# EAGLE design HackflightBrushed (EAGLE 7.7.0)
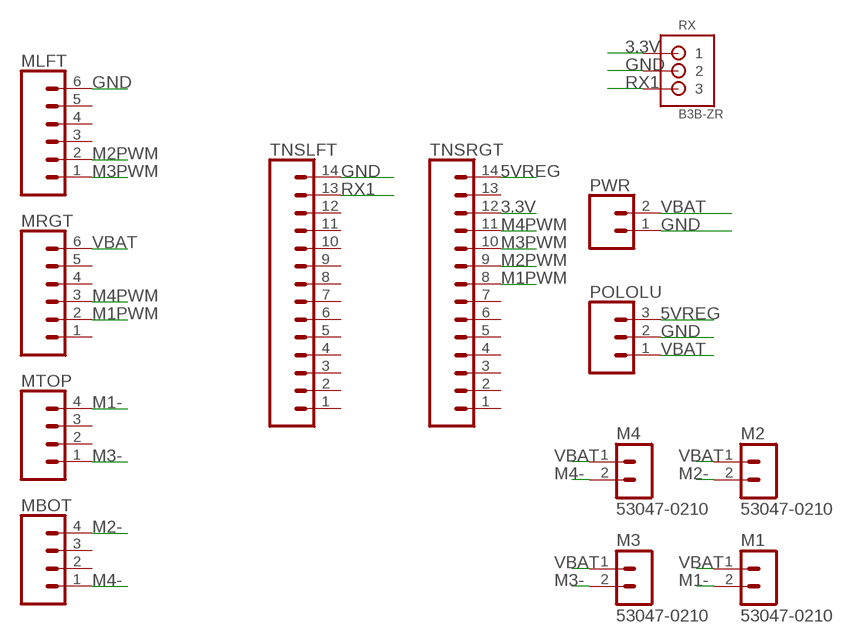
[diagram p0: schematic, sheet 1]

## Parts
M1  53047-0210  [53047-0210]
M2  53047-0210  [53047-0210]
M3  53047-0210  [53047-0210]
M4  53047-0210  [53047-0210]
MBOT  CONN_04  [1X04]
MLFT  CONN_06NO_SILK_FEMALE_PTH  [1X06_NO_SILK]
MRGT  CONN_06NO_SILK_FEMALE_PTH  [1X06_NO_SILK]
MTOP  CONN_04  [1X04]
POLOLU  CONN_03  [1X03]
PWR  CONN_02  [1X02]
RX  B3B-ZR  [B3B-ZR]
TNSLFT  CONN_14  [1X14]
TNSRGT  CONN_14  [1X14]

## Nets
3.3V: RX.1 TNSRGT.12
5VREG: POLOLU.3 TNSRGT.14
GND: MLFT.6 POLOLU.2 PWR.1 RX.2 TNSLFT.14
M1-: M1.2 MTOP.4
M1PWM: MRGT.2 TNSRGT.8
M2-: M2.2 MBOT.4
M2PWM: MLFT.2 TNSRGT.9
M3-: M3.2 MTOP.1
M3PWM: MLFT.1 TNSRGT.10
M4-: M4.2 MBOT.1
M4PWM: MRGT.3 TNSRGT.11
RX1: RX.3 TNSLFT.13
VBAT: M1.1 M2.1 M3.1 M4.1 MRGT.6 POLOLU.1 PWR.2
Unconnected: MBOT.2 MBOT.3 MLFT.3 MLFT.4 MLFT.5 MRGT.1 MRGT.4 MRGT.5 MTOP.2 MTOP.3 TNSLFT.1 TNSLFT.2 TNSLFT.3 TNSLFT.4 TNSLFT.5 TNSLFT.6 TNSLFT.7 TNSLFT.8 TNSLFT.9 TNSLFT.10 TNSLFT.11 TNSLFT.12 TNSRGT.1 TNSRGT.2 TNSRGT.3 TNSRGT.4 TNSRGT.5 TNSRGT.6 TNSRGT.7 TNSRGT.13

## Library data of the parts
M1-M4 = con-molex-picoblade:53047-0210: HEADER
MBOT MTOP = SparkFun-Connectors:CONN_04: Multi connection point. Often used as Generic Header-pin footprint for 0.1 inch spaced/style header connections On any of the 0.1 inch spaced packages, you can populate with these: Break Away Headers - Straight <https://www.sparkfun.com/products/116> (PRT-00116) Break Away Male Headers - Right Angle <https://www.sparkfun.com/products/553> (PRT-00553) Female Headers <https://www.sparkfun.com/products/115> (PRT-00115) Break Away Headers - Machine Pin <https://www.sparkfun.com/products/117> (PRT-00117) Break Away Female Headers - Swiss Machine Pin <https://www.sparkfun.com/products/743> (PRT-00743) For SCREWTERMINALS and SPRING TERMINALS visit here: Screw Terimnals on SparkFun.com <https://www.sparkfun.com/search/results?term=Screw+Terminals> (5mm/3.5mm/2.54mm spacing) This device is also useful as a general connection point to wire up your design to another part of your project. Our various solder wires solder well into these plated through hole pads. Hook-Up Wire - Assortment (Stranded, 22 AWG) <https://www.sparkfun.com/products/11375> (PRT-11375) Hook-Up Wire - Assortment (Solid Core, 22 AWG) <https://www.sparkfun.com/products/11367> (PRT-11367) View the entire wire category on our website here <https://www.sparkfun.com/categories/141> Special notes: Molex polarized connector foot print use with SKU : PRT-08231 with associated crimp pins and housings. 1MM SMD Version SKU: PRT-10208; PROD_ID: CONN-09696
MLFT MRGT = SparkFun-Connectors:CONN_06: Multi connection point. Often used as Generic Header-pin footprint for 0.1 inch spaced/style header connections On any of the 0.1 inch spaced packages, you can populate with these: Break Away Headers - Straight <https://www.sparkfun.com/products/116> (PRT-00116) Break Away Male Headers - Right Angle <https://www.sparkfun.com/products/553> (PRT-00553) Female Headers <https://www.sparkfun.com/products/115> (PRT-00115) Break Away Headers - Machine Pin <https://www.sparkfun.com/products/117> (PRT-00117) Break Away Female Headers - Swiss Machine Pin <https://www.sparkfun.com/products/743> (PRT-00743) Arduino Stackable Header - 6 Pin <https://www.sparkfun.com/products/9280> (PRT-09280) For SCREWTERMINALS and SPRING TERMINALS visit here: Screw Terimnals on SparkFun.com <https://www.sparkfun.com/search/results?term=Screw+Terminals> (5mm/3.5mm/2.54mm spacing) This device is also useful as a general connection point to wire up your design to another part of your project. Our various solder wires solder well into these plated through hole pads. Hook-Up Wire - Assortment (Stranded, 22 AWG) <https://www.sparkfun.com/products/11375> (PRT-11375) Hook-Up Wire - Assortment (Solid Core, 22 AWG) <https://www.sparkfun.com/products/11367> (PRT-11367) View the entire wire category on our website here <https://www.sparkfun.com/categories/141>; PROD_ID: CONN-08437
POLOLU = SparkFun-Connectors:CONN_03: Multi connection point. Often used as Generic Header-pin footprint for 0.1 inch spaced/style header connections On any of the 0.1 inch spaced packages, you can populate with these: Break Away Headers - Straight <https://www.sparkfun.com/products/116> (PRT-00116) Break Away Male Headers - Right Angle <https://www.sparkfun.com/products/553> (PRT-00553) Female Headers <https://www.sparkfun.com/products/115> (PRT-00115) Break Away Headers - Machine Pin <https://www.sparkfun.com/products/117> (PRT-00117) Break Away Female Headers - Swiss Machine Pin <https://www.sparkfun.com/products/743> (PRT-00743) Stackable Header - 3 Pin (Female, 0.1") <https://www.sparkfun.com/products/13875> (PRT-13875) For SCREWTERMINALS and SPRING TERMINALS visit here: Screw Terimnals on SparkFun.com <https://www.sparkfun.com/search/results?term=Screw+Terminals> (5mm/3.5mm/2.54mm spacing) This device is also useful as a general connection point to wire up your design to another part of your project. Our various solder wires solder well into these plated through hole pads. Hook-Up Wire - Assortment (Stranded, 22 AWG) <https://www.sparkfun.com/products/11375> (PRT-11375) Hook-Up Wire - Assortment (Solid Core, 22 AWG) <https://www.sparkfun.com/products/11367> (PRT-11367) View the entire wire category on our website here <https://www.sparkfun.com/categories/141> Special notes: Molex polarized connector foot print use with SKU : PRT-08232 with associated crimp pins and housings.
PWR = SparkFun-Connectors:CONN_02: Multi connection point. Often used as Generic Header-pin footprint for 0.1 inch spaced/style header connections On any of the 0.1 inch spaced packages, you can populate with these: Break Away Headers - Straight <https://www.sparkfun.com/products/116> (PRT-00116) Break Away Male Headers - Right Angle <https://www.sparkfun.com/products/553> (PRT-00553) Female Headers <https://www.sparkfun.com/products/115> (PRT-00115) Break Away Headers - Machine Pin <https://www.sparkfun.com/products/117> (PRT-00117) Break Away Female Headers - Swiss Machine Pin <https://www.sparkfun.com/products/743> (PRT-00743) For SCREWTERMINALS and SPRING TERMINALS visit here: Screw Terimnals on SparkFun.com <https://www.sparkfun.com/search/results?term=Screw+Terminals> (5mm/3.5mm/2.54mm spacing) This device is also useful as a general connection point to wire up your design to another part of your project. Our various solder wires solder well into these plated through hole pads. Hook-Up Wire - Assortment (Stranded, 22 AWG) <https://www.sparkfun.com/products/11375> (PRT-11375) Hook-Up Wire - Assortment (Solid Core, 22 AWG) <https://www.sparkfun.com/products/11367> (PRT-11367) View the entire wire category on our website here <https://www.sparkfun.com/categories/141> Special notes: Molex polarized connector foot print use with: PRT-08233 with associated crimp pins and housings. 2.54_SCREWTERM for use with PRT-10571. 3.5mm Screw Terminal footprints for PRT-08084 5mm Screw Terminal footprints for use with PRT-08432
RX = jst:B3B-ZR: JST-ZH Connector 3 pol, 1.5mm pitch Package: B3B-ZR Source: http://www.jst-mfg.com/product/pdf/eng/eZH.pdf
TNSLFT TNSRGT = SparkFun-Connectors:CONN_14: Multi connection point. Often used as Generic Header-pin footprint for 0.1 inch spaced/style header connections On any of the 0.1 inch spaced packages, you can populate with these: Break Away Headers - Straight <https://www.sparkfun.com/products/116> (PRT-00116) Break Away Male Headers - Right Angle <https://www.sparkfun.com/products/553> (PRT-00553) Female Headers <https://www.sparkfun.com/products/115> (PRT-00115) Break Away Headers - Machine Pin <https://www.sparkfun.com/products/117> (PRT-00117) Break Away Female Headers - Swiss Machine Pin <https://www.sparkfun.com/products/743> (PRT-00743) For SCREWTERMINALS and SPRING TERMINALS visit here: Screw Terimnals on SparkFun.com <https://www.sparkfun.com/search/results?term=Screw+Terminals> (5mm/3.5mm/2.54mm spacing) This device is also useful as a general connection point to wire up your design to another part of your project. Our various solder wires solder well into these plated through hole pads. Hook-Up Wire - Assortment (Stranded, 22 AWG) <https://www.sparkfun.com/products/11375> (PRT-11375) Hook-Up Wire - Assortment (Solid Core, 22 AWG) <https://www.sparkfun.com/products/11367> (PRT-11367) View the entire wire category on our website here <https://www.sparkfun.com/categories/141> Special notes: Molex polarized connector foot print use with SKU : PRT-08231 with associated crimp pins and housings. 1MM SMD Version SKU: PRT-10208 NOTES ON THE VARIANTS LOCK and LOCK_LONGPADS... This footprint was designed to help hold the alignment of a through-hole component (i.e. 6-pin header) while soldering it into place. You may notice that each hole has been shifted either up or down by 0.005 of an inch from it's more standard position (which is a perfectly straight line). This slight alteration caused the pins (the squares in the middle) to touch the edges of the holes. Because they are alternating, it causes a "brace" to hold the component in place. 0.005 has proven to be the perfect amount of "off-center" position when using our standard breakaway headers. Although looks a little odd when you look at the bare footprint, once you have a header in there, the alteration is very hard to notice. Also,if you push a header all the way into place, it is covered up entirely on the bottom side.

## Board
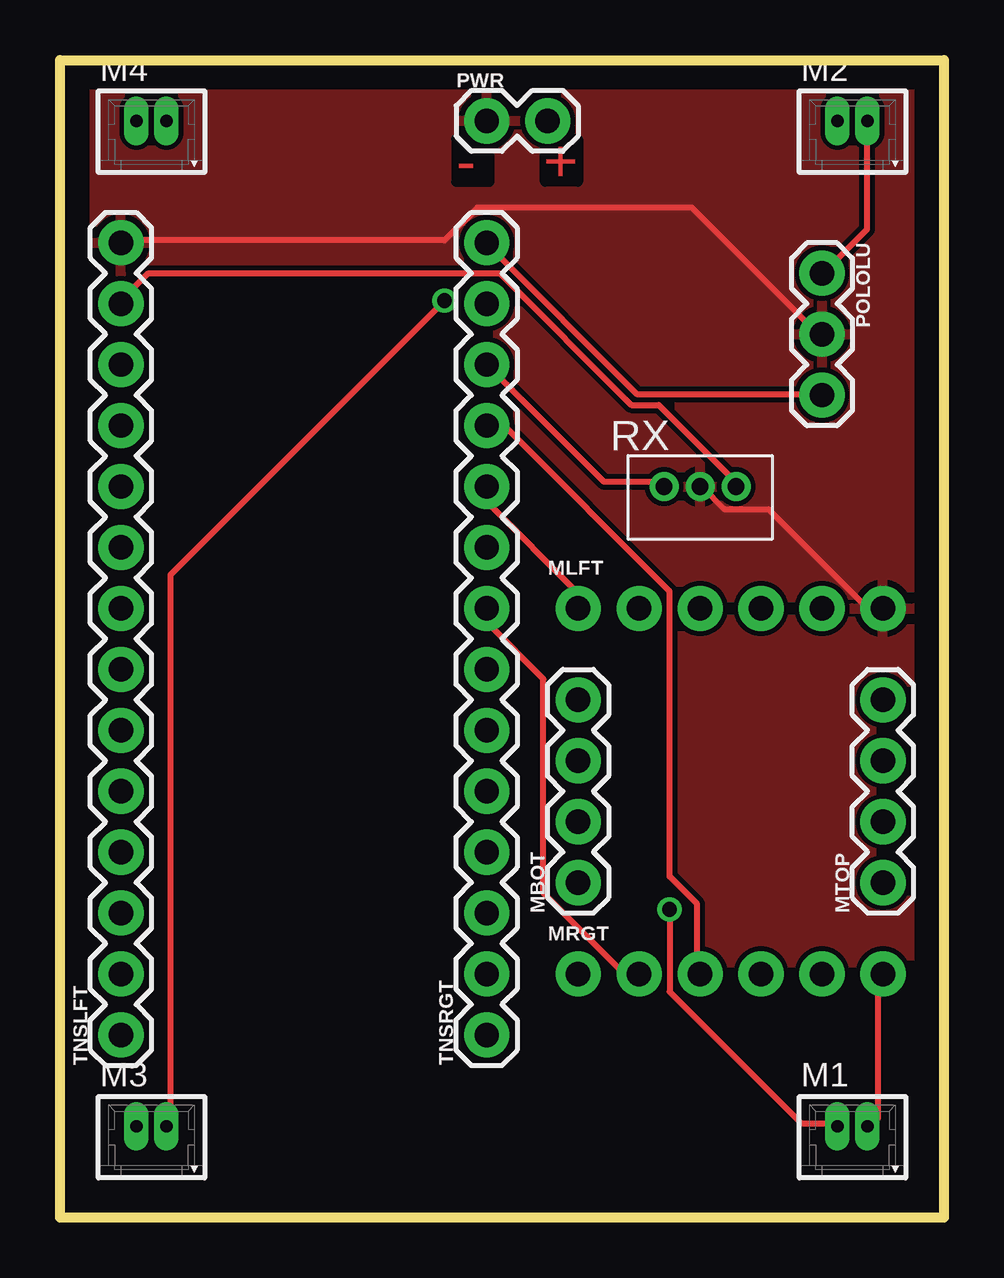
[diagram p1: board, top side]
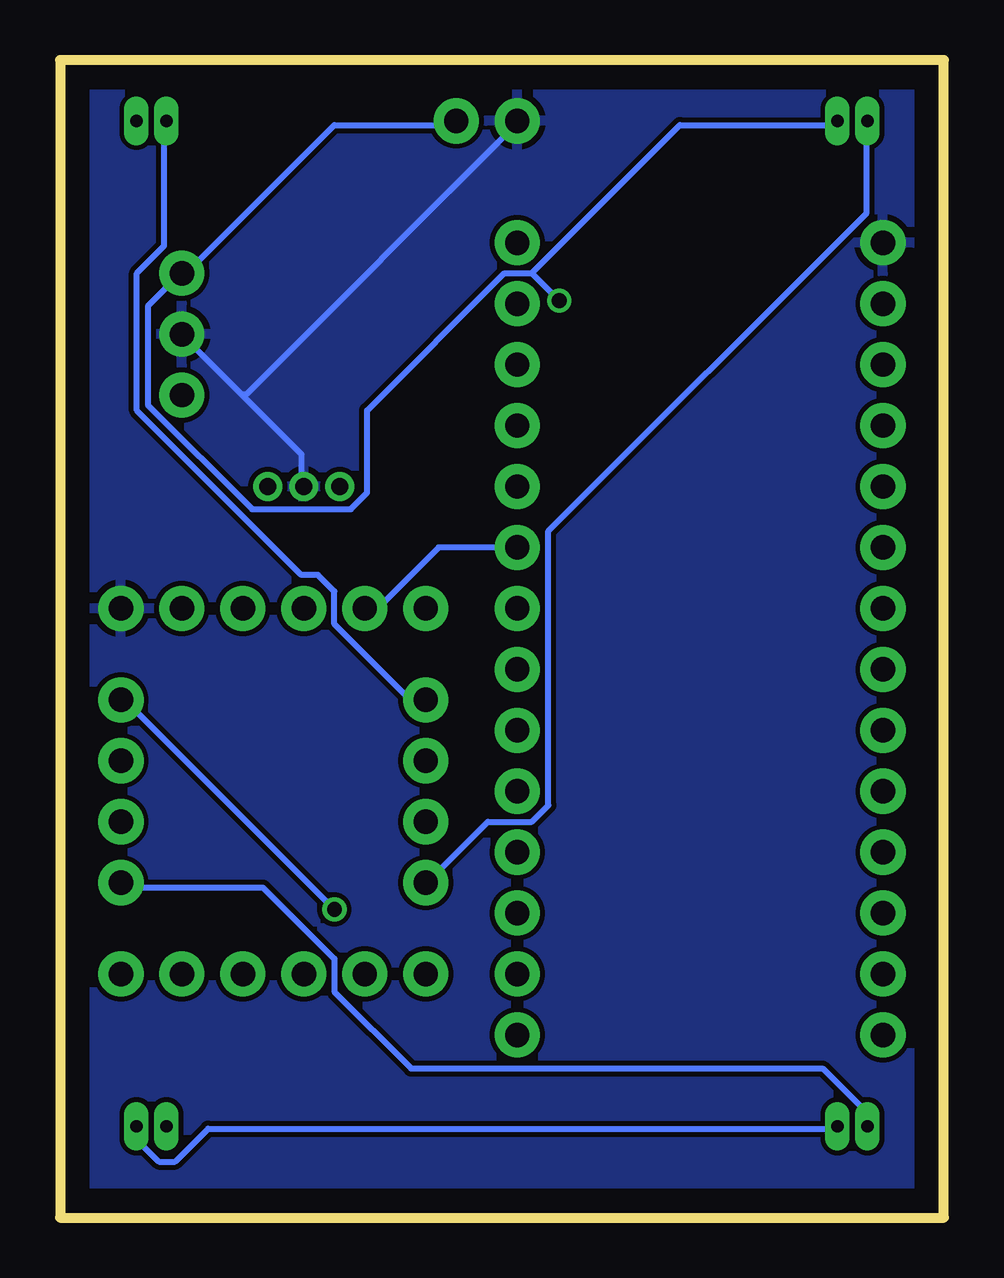
[diagram p2: board, bottom side, seen from below]

Size 36.83 x 48.26 mm. Coordinates in mm from the lower left corner, seen from the top.
Outline: 0,48.26 36.83,48.26 36.83,0 0,0 0,48.26
Copper layers (1*16): Top 0.035mm / dielectric 1.5mm / Bottom 0.035mm
Design rules "default": minimum track width 10mil, minimum drill 24mil, track to track 8mil, track to pad 8mil, pad to pad 8mil, via to via 8mil, smd to smd 8mil, copper to edge 40mil, drill to drill 8mil, minimum pad ring 10mil, minimum via ring 8mil, stop-mask expansion 4mil, vias tented up to drill 0mil, thermal gap 10mil

### Footprints (pad centres in the part's own frame; a part is rotated, then mirrored left to right if it is on the bottom)
53047-0210 = drill 0.508 long: 1 0.625,0; 2 -0.625,0
1X04 = drill 1.016 pad 1.88: 1 0,0; 2 2.54,0; 3 5.08,0; 4 7.62,0
1X06_NO_SILK = drill 1.016 pad 1.88: 1 0,0; 2 2.54,0; 3 5.08,0; 4 7.62,0; 5 10.16,0; 6 12.7,0
1X03 = drill 1.016 pad 1.88: 1 0,0; 2 2.54,0; 3 5.08,0
1X02 = drill 1.016 pad 1.88: 1 0,0; 2 2.54,0
B3B-ZR = drill 0.7 pad 1.1: 1 -1.5,0; 2 0,0; 3 1.5,0
1X14 = drill 1.016 pad 1.88: 1 0,0; 2 2.54,0; 3 5.08,0; 4 7.62,0; 5 10.16,0; 6 12.7,0; 7 15.24,0; 8 17.78,0; 9 20.32,0; 10 22.86,0; 11 25.4,0; 12 27.94,0; 13 30.48,0; 14 33.02,0

### Placement (x,y rotation side)
M1  33.02,3.81 0 top
M2  33.02,45.72 0 top
M3  3.81,3.81 0 top
M4  3.81,45.72 0 top
MBOT  21.59,13.97 90 top
MLFT  21.59,25.4 0 top
MRGT  21.59,10.16 0 top
MTOP  34.29,13.97 90 top
POLOLU  31.75,39.37 270 top
PWR  17.78,45.72 0 top
RX  26.67,30.48 0 top
TNSLFT  2.54,7.62 90 top
TNSRGT  17.78,7.62 90 top

### Tracks (layer width: path | path; a pad name or v marks a point on that pad's centre or on a via)
3.3V
  Top 0.254: TNSRGT.12 22.66,30.68 24.94,30.68 RX.1
5VREG
  Top 0.254: POLOLU.3 31.57,34.34 24.03,34.34 17.86,40.51 TNSRGT.14
GND
  Top 0.254: TNSLFT.14 2.54,40.74 16.03,40.74 17.4,42.11 26.31,42.11 31.57,36.85 POLOLU.2 | MLFT.6 34.09,25.42 33.63,25.42 29.52,29.54 27.69,29.54 26.77,30.45 RX.2
  Bottom 0.254: 29.29,34.34 31.57,36.63 POLOLU.2 | 29.29,34.34 26.77,31.83 26.77,30.68 RX.2 | 29.29,34.34 29.06,34.34 17.86,45.54 PWR.1
  pour Top: 0,48.26 36.83,48.26 36.83,0 0,0
  pour Bottom: 0,48.26 36.83,48.26 36.83,0 0,0
M1-  (via drill 0.61)
  Top 0.254: v25.4,12.85 25.4,9.42 30.89,3.94 32.26,3.94 M1.2
  Bottom 0.254: v25.4,12.85 34.09,21.54 MTOP.4
M1PWM
  Top 0.254: TNSRGT.8 17.86,25.2 17.86,24.74 20.14,22.45 20.14,13.54 23.34,10.34 24.03,10.34 MRGT.2
M2-
  Bottom 0.254: M2.2 32.49,45.54 32.49,40.51 33.63,39.37 33.63,33.66 26.77,26.8 26.09,26.8 25.4,26.11 25.4,24.74 22.43,21.77 21.74,21.77 MBOT.4
M2PWM
  Bottom 0.254: TNSRGT.9 21.06,27.94 23.57,25.42 24.03,25.42 MLFT.2
M3-
  Bottom 0.254: M3.2 3.23,3.94 3.23,4.39 5.05,6.22 22.2,6.22 25.4,9.42 25.4,10.8 28.37,13.77 34.09,13.77 MTOP.1
M3PWM
  Top 0.254: TNSRGT.10 17.86,30.45 17.86,29.77 21.51,26.11 21.51,25.42 MLFT.1
M4-
  Bottom 0.254: M4.2 3.23,45.54 3.23,41.88 16.48,28.63 16.48,17.2 17.17,16.51 19,16.51 21.51,13.99 MBOT.1
M4PWM
  Top 0.254: TNSRGT.11 17.86,32.97 18.54,32.97 25.4,26.11 25.4,14.22 26.54,13.08 26.54,10.34 MRGT.3
RX1
  Top 0.254: RX.3 28.14,30.68 24.94,33.88 23.8,33.88 18.31,39.37 3.68,39.37 2.54,38.23 TNSLFT.13
VBAT  (via drill 0.61)
  Top 0.254: MRGT.6 34.09,10.11 34.09,4.17 33.86,3.94 M1.1 | M2.1 33.63,45.54 33.63,41.2 31.8,39.37 POLOLU.1 | v16.03,38.23 4.6,26.8 4.6,3.94 M3.1
  Bottom 0.254: M3.1 4.6,3.71 30.66,3.71 32.03,2.34 32.71,2.34 33.63,3.25 33.63,3.71 M1.1 | 17.17,39.37 11,45.54 4.6,45.54 M4.1 | 17.17,39.37 18.31,39.37 24.03,33.66 24.03,30.23 24.71,29.54 28.83,29.54 33.17,33.88 33.17,38 31.8,39.37 POLOLU.1 31.57,39.37 25.4,45.54 20.37,45.54 PWR.2 | 17.17,39.37 v16.03,38.23

### Text on the board
Top: - | +